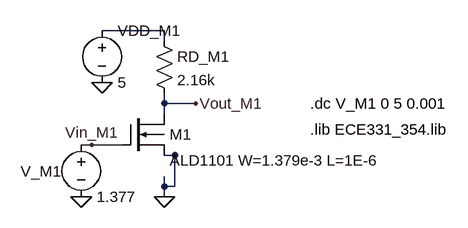
[diagram p0: schematic dc_sweep_M1.asc]
dc_sweep_M1.asc, the LTspice schematic file:
Version 4
SHEET 1 880 680
WIRE -496 -32 -592 -32
WIRE -496 -16 -496 -32
WIRE -496 80 -496 64
WIRE -448 80 -496 80
WIRE -496 96 -496 80
WIRE -608 144 -624 144
WIRE -560 144 -608 144
WIRE -480 160 -496 160
WIRE -496 208 -496 192
WIRE -480 208 -480 160
WIRE -480 208 -496 208
WIRE -496 224 -496 208
FLAG -592 48 0
FLAG -496 224 0
FLAG -624 224 0
FLAG -448 80 Vout_M1
FLAG -608 144 Vin_M1
SYMBOL ECE331\\ALD1101 -560 96 R0
SYMATTR InstName M1
SYMBOL voltage -592 -48 R0
WINDOW 123 0 0 Left 0
WINDOW 39 0 0 Left 0
SYMATTR InstName VDD_M1
SYMATTR Value 5
SYMBOL res -512 -32 R0
SYMATTR InstName RD_M1
SYMATTR Value 2.16k
SYMBOL voltage -624 128 R0
WINDOW 123 0 0 Left 0
WINDOW 39 0 0 Left 0
WINDOW 0 -93 57 Left 2
SYMATTR InstName V_M1
SYMATTR Value 1.377
TEXT -272 80 Left 2 !.dc V_M1 0 5 0.001
TEXT -272 120 Left 2 !.lib ECE331_354.lib

The netlist it stands for:
* dc_sweep_M1.asc
M1 Vout_M1 Vin_M1 0 0 ALD1101 W=1.379e-3 L=1E-6
VDD_M1 N001 0 5
RD_M1 N001 Vout_M1 2.16k
V_M1 Vin_M1 0 1.377
.model NMOS NMOS
.model PMOS PMOS
.lib standard.mos
.dc V_M1 0 5 0.001
.lib ECE331_354.lib
.backanno
.end

* Results of the author's LTspice run, read from the files saved beside the schematic
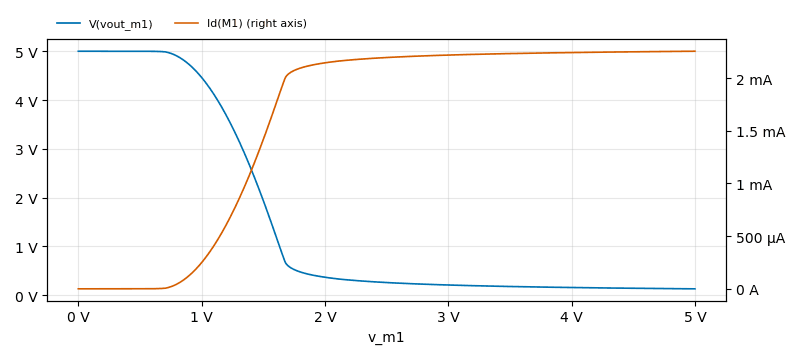
[diagram p1: DC transfer characteristic of dc_sweep_M1.asc, plotted from the saved traces]
* DC transfer characteristic, 1 run:
*   V(vout_m1): 5 V at v_m1=0 V, 129.3 mV at v_m1=5 V, min 129.3 mV, max 5 V
*   Id(M1): 21.44 pA at v_m1=0 V, 2.255 mA at v_m1=5 V, min 21.44 pA, max 2.255 mA